# Altium schematic sheet gan_buck.SchDoc: GaN Step-down
size A4; Organization: GPA Robotics; DocumentNumber: 7; Revision: REV 0; SheetNumber: 7; SheetTotal: 11
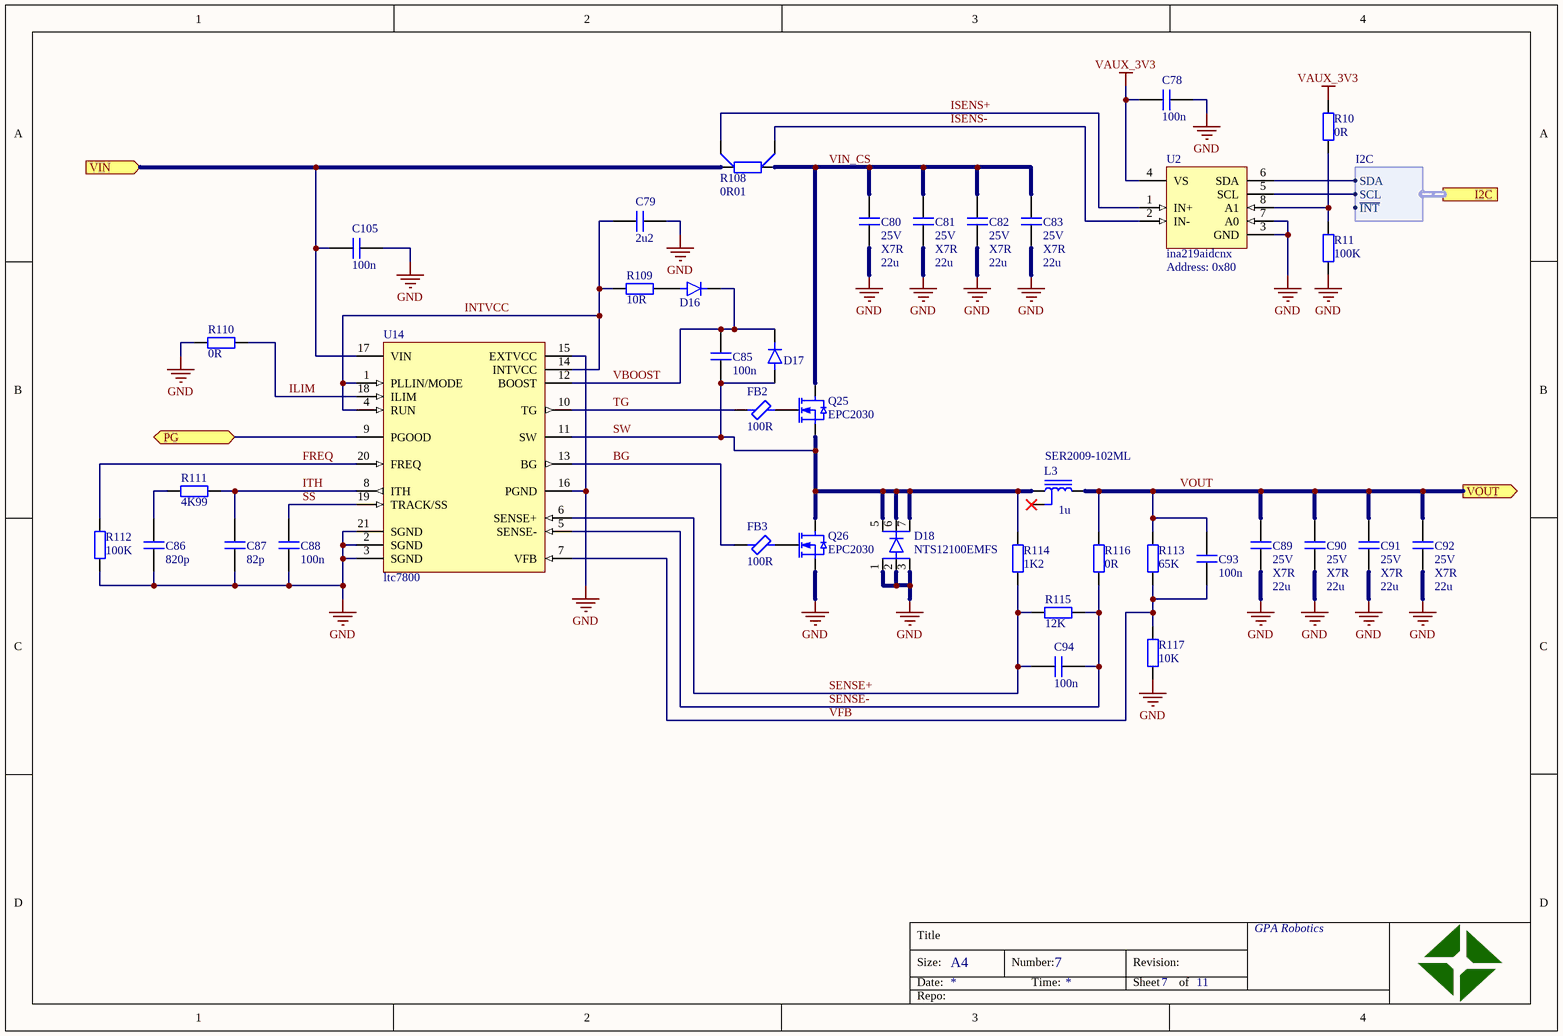
[diagram p0: gan_buck.SchDoc]

## Parts
C78  value 100n  [CAPC1005X06N]  (hidden comment: cap)
C79  value 2u2  [CAPC2012X11N]  (hidden comment: cap)
C80  value 22u  voltage: 25V  type: X7R  [CAPC3225X14N]  (hidden comment: cap)
C81  value 22u  voltage: 25V  type: X7R  [CAPC3225X14N]  (hidden comment: cap)
C82  value 22u  voltage: 25V  type: X7R  [CAPC3225X14N]  (hidden comment: cap)
C83  value 22u  voltage: 25V  type: X7R  [CAPC3225X14N]  (hidden comment: cap)
C85  value 100n  [CAPC1608X08N]  (hidden comment: cap)
C86  value 820p  [CAPC1005X06N]  (hidden comment: cap)
C87  value 82p  [CAPC1005X06N]  (hidden comment: cap)
C88  value 100n  [CAPC1005X06N]  (hidden comment: cap)
C89  value 22u  voltage: 25V  type: X7R  [CAPC3225X14N]  (hidden comment: cap)
C90  value 22u  voltage: 25V  type: X7R  [CAPC3225X14N]  (hidden comment: cap)
C91  value 22u  voltage: 25V  type: X7R  [CAPC3225X14N]  (hidden comment: cap)
C92  value 22u  voltage: 25V  type: X7R  [CAPC3225X14N]  (hidden comment: cap)
C93  value 100n  [CAPC1005X06N]  (hidden comment: cap)
C94  value 100n  [CAPC1005X06N]  (hidden comment: cap)
C105  value 100n  [CAPC1005X06N]  (hidden comment: cap)
D16  DFLS2100  [SODFL370X100-2N_DFLS2100]  (value not drawn)
D17  diode  [CAPCP1005X06N]  (value not drawn)
D18  NTS12100EMFS  [SON127P620X110_HS-9N_NTS12100]
FB2  value 100R  [INDC1005X06N]  (hidden comment: ferrite)
FB3  value 100R  [INDC1005X06N]  (hidden comment: ferrite)
L3  SER2009-102ML  value 1u  [SER20xx]
Q25  EPC2030  [epc2030_die]
Q26  EPC2030  [epc2030_die]
R10  value 0R  [RESC1005X04N]  (hidden comment: res)
R11  value 100K  [RESC1005X04N]  (hidden comment: res)
R108  value 0R01  [4T_RESC1632X05N]  (hidden comment: res_4t)
R109  value 10R  [RESC2012X06N]  (hidden comment: res)
R110  value 0R  [RESC1005X04N]  (hidden comment: res)
R111  value 4K99  [RESC1005X04N]  (hidden comment: res)
R112  value 100K  [RESC1005X04N]  (hidden comment: res)
R113  value 65K  [RESC1005X04N]  (hidden comment: res)
R114  value 1K2  [RESC1005X04N]  (hidden comment: res)
R115  value 12K  [RESC1005X04N]  (hidden comment: res)
R116  value 0R  [RESC1005X04N]  (hidden comment: res)
R117  value 10K  [RESC1005X04N]  (hidden comment: res)
U2  ina219aidcnx  Address: 0x80  [TSOP65P280X145-8N]
U14  ltc7800  [QFN50P300X400X80_HS-21N_LTC7800]

## Ports
I2C (harness I2C), PG (bidir), VIN (in), VOUT (out)

## Harnesses
I2C: SDA, SCL, ~{INT}

## Nets
GND: C78.1 C79.2 C80.2 C81.2 C82.2 C83.2 C86.1 C87.1 C88.1 C89.2 C90.2 C91.2 C92.2 C105.2 D18.1 D18.2 D18.3 Q26.S R11.1 R110.2 R112.1 R117.1 U2.3(GND) U2.7(A0) U14.2(SGND) U14.3(SGND) U14.15(EXTVCC) U14.16(PGND) U14.21(SGND)
VAUX_3V3: C78.2 R10.2 U2.4(VS)
BG: FB3.1 U14.13(BG)
FREQ: R112.2 U14.20(FREQ)
ILIM: R110.1 U14.18(ILIM)
INTVCC: C79.1 R109.1 U14.1(PLLIN/MODE) U14.4(RUN) U14.14(INTVCC)
ISENS+: R108.4 U2.1(IN+)
ISENS-: R108.3 U2.2(IN-)
ITH: C87.2 R111.2 U14.8(ITH)
PG: U14.9(PGOOD) ; port PG
SENSE+: C94.1 R114.1 R115.2 U14.6(SENSE+)
SENSE-: C94.2 R115.1 R116.1 U14.5(SENSE-)
SS: C88.2 U14.19(TRACK/SS)
SW: C85.1 D17.A D18.5 D18.6 D18.7 L3.2 Q25.S Q26.D R114.2 U14.11(SW)
TG: FB2.1 U14.10(TG)
VBOOST: C85.2 D16.C D17.C U14.12(BOOST)
VFB: C93.1 R113.1 R117.2 U14.7(VFB)
VIN: C105.1 R108.2 U14.17(VIN) ; port VIN
VIN_CS: C80.1 C81.1 C82.1 C83.1 Q25.D R108.1
VOUT: C89.1 C90.1 C91.1 C92.1 C93.2 L3.1 R113.2 R116.2 ; port VOUT
NetC86_2: C86.2 R111.1
NetD16_A: D16.A R109.2
NetFB2_2: FB2.2 Q25.G
NetFB3_2: FB3.2 Q26.G
NetR10_1: R10.1 R11.2 U2.8(A1)
NetU2_5: U2.5(SCL) ; port I2C.SCL
NetU2_6: U2.6(SDA) ; port I2C.SDA

Not connected (* = marked no-connect by the designer): L3 3*

## Notes on the sheet
- Title
- Size:
- Date:
- A4
- Number:
- Time:
- Revision:
- Sheet
- of
- Repo:

## Library data of the parts
C78-C83 C85-C94 C105 = cap: Capacitor; #digikey: *; #mouser: *
  C78 C79 C85-C88 C93 C94 C105: voltage: *; type: *
D16 = dfls2100: 2.0A HIGH VOLTAGE SCHOTTKY BARRIER RECTIFIER; ComponentLink1Description: datasheet; ComponentLink1URL: https://www.diodes.com/assets/Datasheets/ds31475.pdf
D17 = diode: pin to pad: A>1 C>2
D18 = nts12100emfs: Very Low LeakageTrench-based SchottkyRectifier; ComponentLink1Description: datasheet; ComponentLink1URL: https://www.onsemi.com/pub/Collateral/NTS12100EMFS-D.PDF
FB2 FB3 = ferrite: Inductor; #digikey: *; #mouser: *
L3 = ser20xx: Shielded Power Inductor; ComponentLink1Description: specs; ComponentLink1URL: https://www.coilcraft.com/pdfs/ser2000.pdf
Q25 Q26 = epc2030: GaN Enhancement Mode Power Transistor; ComponentLink1Description: datasheet; ComponentLink1URL: https://epc-co.com/epc/Portals/0/epc/documents/datasheets/EPC2030_datasheet.pdf
R10 R11 R109-R117 = res: Resistor; power: *; voltage: *; #digikey: *; #mouser: *
R108 = res_4t: Resistor; power: *; #digikey: *; #mouser: *
U2 = ina219aidcnx: INA219 Zero-Drift, Bidirectional Current/Power Monitor With I2C Interface; ComponentLink1Description: Datasheet; ComponentLink1URL: https://www.ti.com/lit/ds/symlink/ina219.pdf?&ts=1589650364826; Supplier 1: Digi-Key; Supplier Part Number 1: 296-23770-1-ND
U14 = ltc7800: Low IQ, 60V, High Frequency Synchronous Step-Down Controller; ComponentLink1Description: datasheet; ComponentLink1URL: https://www.analog.com/media/en/technical-documentation/data-sheets/7800f.pdf